# EAGLE design BatteryTemp (EAGLE 7.4.0)
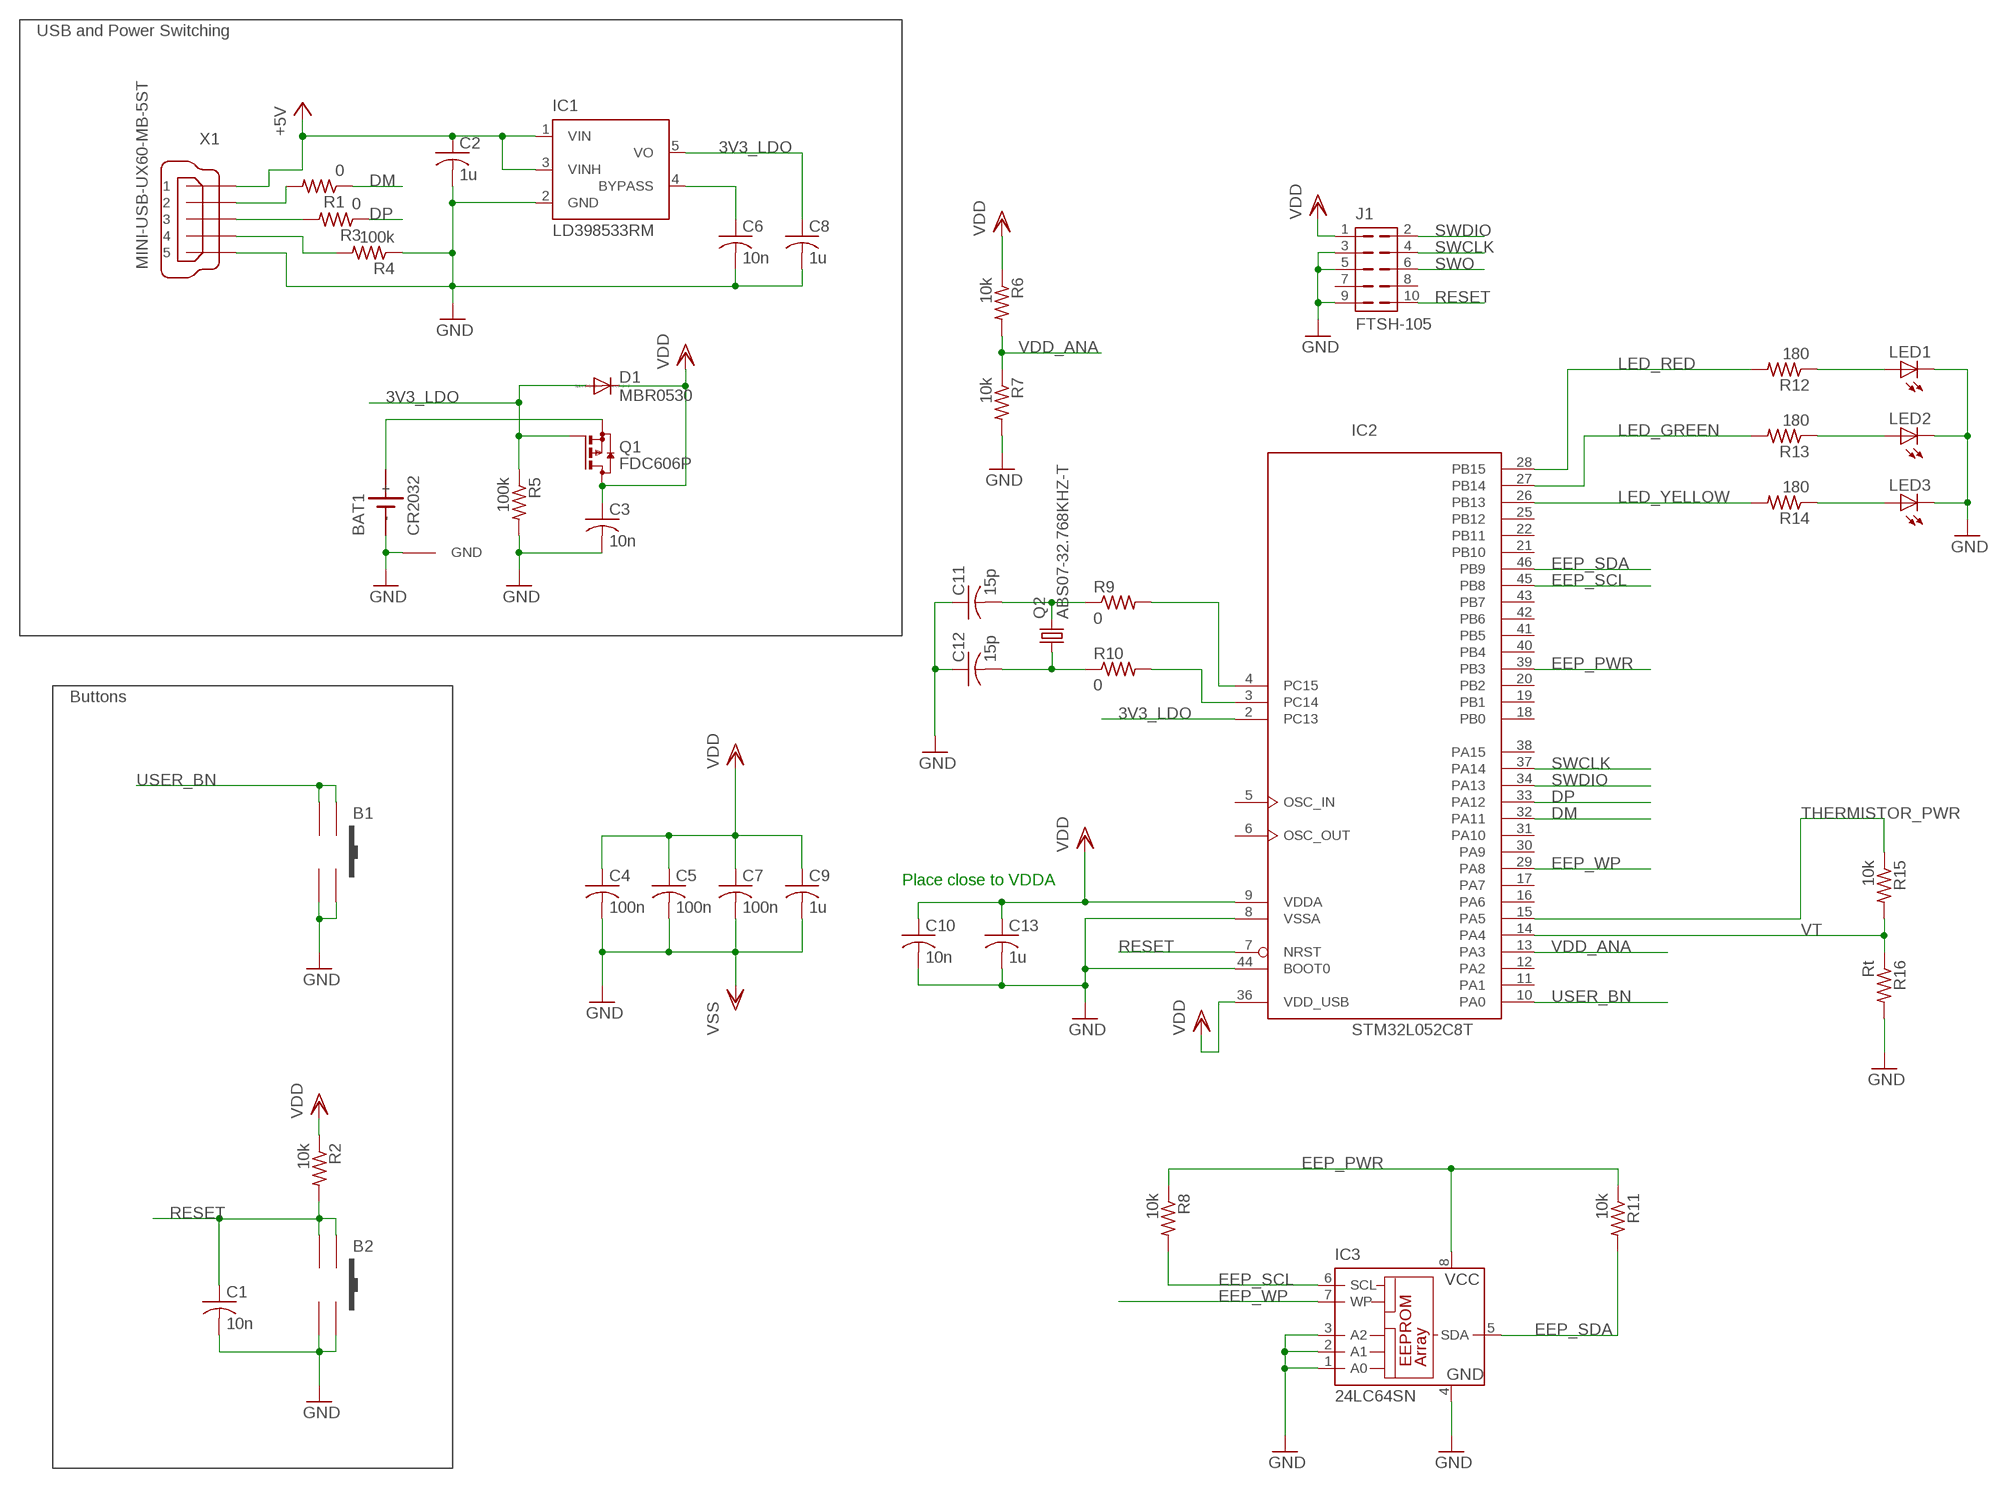
[diagram p0: schematic, sheet 1]

## Parts
B1  PTS525SM10SMTR  [PTS525SM10SMTR]
B2  PTS525SM10SMTR  [PTS525SM10SMTR]
BAT1  CR2032  SN2032  [COIN_CELL]
C1  10n  C-USC0603  [C0603]
C2  1u  C-USC0603  [C0603]
C3  10n  C-USC0603  [C0603]
C4  100n  C-USC0603  [C0603]
C5  100n  C-USC0603  [C0603]
C6  10n  C-USC0603  [C0603]
C7  100n  C-USC0603  [C0603]
C8  1u  C-USC0603  [C0603]
C9  1u  C-USC0603  [C0603]
C10  10n  C-USC0603  [C0603]
C11  15p  C-USC0603  [C0603]
C12  15p  C-USC0603  [C0603]
C13  1u  C-USC0603  [C0603]
D1  MBR0530  CGRM4001-G  [SOD-123_MINI-SMA]
IC1  LD398533RM  [SOT23-5L]
IC2  STM32L052C8T  [LQFP48]
IC3  24LC64SN  [SO-08]
J1  FTSH-105  [FTSH-105-01-XXX-DV-K]
LED1  LEDCHIP-LED0603  [CHIP-LED0603]
LED2  LEDCHIP-LED0603  [CHIP-LED0603]
LED3  LEDCHIP-LED0603  [CHIP-LED0603]
Q1  FDC606P  [SOT-23-6]
Q2  ABS07-32.768KHZ-T  [2-SMD]
R1  0  R-US_R0603  [R0603]
R2  10k  R-US_R0603  [R0603]
R3  0  R-US_R0603  [R0603]
R4  100k  R-US_R0603  [R0603]
R5  100k  R-US_R0603  [R0603]
R6  10k  R-US_R0603  [R0603]
R7  10k  R-US_R0603  [R0603]
R8  10k  R-US_R0603  [R0603]
R9  0  R-US_R0603  [R0603]
R10  0  R-US_R0603  [R0603]
R11  10k  R-US_R0603  [R0603]
R12  180  R-US_R0603  [R0603]
R13  180  R-US_R0603  [R0603]
R14  180  R-US_R0603  [R0603]
R15  10k  R-US_R0603  [R0603]
R16  Rt  R-US_R0603  [R0603]
T1  GND_LUG  [GND_PAD]
X1  MINI-USB-UX60-MB-5ST  [UX60-MB-5ST]

## Nets
3V3_LDO: C8.1 D1.A IC1.5(VO) IC2.2(PC13) Q1.3(G) R5.1
+5V: C2.1 IC1.1(VIN) IC1.3(VINH) X1.1
DM: IC2.32(PA11) R1.1
DP: IC2.33(PA12) R3.1
EEP_PWR: IC2.39(PB3) IC3.8(VCC) R8.1 R11.1
EEP_SCL: IC2.45(PB8) IC3.6(SCL) R8.2
EEP_SDA: IC2.46(PB9) IC3.5(SDA) R11.2
EEP_WP: IC2.29(PA8) IC3.7(WP)
GND: B1.3 B1.4 B2.3 B2.4 BAT1.GND1(-) C1.2 C2.2 C3.2 C4.2 C5.2 C6.2 C7.2 C8.2 C9.2 C10.2 C11.1 C12.1 C13.2 IC1.2(GND) IC2.8(VSSA) IC2.44(BOOT0) IC3.1(A0) IC3.2(A1) IC3.3(A2) IC3.4(GND) J1.3 J1.5 J1.9 LED1.C LED2.C LED3.C R4.1 R5.2 R7.2 R16.2 T1.P$1(GND) X1.5 ; supply symbol labelled VSS
LED_GREEN: IC2.27(PB14) R13.2
LED_RED: IC2.28(PB15) R12.2
LED_YELLOW: IC2.26(PB13) R14.2
N$1: R1.2 X1.2
N$2: R3.2 X1.3
N$3: R4.2 X1.4
N$4: BAT1.VPLUS1(+) BAT1.VPLUS2(+) Q1.4(S)
N$5: LED1.A R12.1
N$6: C6.1 IC1.4(BYPASS)
N$7: C11.2 Q2.P$2 R9.1
N$8: LED2.A R13.1
N$9: LED3.A R14.1
N$10: C12.2 Q2.P$1 R10.1
N$11: IC2.4(PC15) R9.2
N$12: IC2.3(PC14) R10.2
RESET: B2.1 B2.2 C1.1 IC2.7(NRST) J1.10 R2.2
SWCLK: IC2.37(PA14) J1.4
SWDIO: IC2.34(PA13) J1.2
SWO: J1.6
THERMISTOR_PWR: IC2.15(PA5) R15.1
USER_BN: B1.1 B1.2 IC2.10(PA0)
VDD: C3.1 C4.1 C5.1 C7.1 C9.1 C10.1 C13.1 D1.C IC2.9(VDDA) IC2.36(VDD_USB) J1.1 Q1.1(D) Q1.2(D) Q1.5(D) Q1.6(D) R2.1 R6.1
VDD_ANA: IC2.13(PA3) R6.2 R7.1
VT: IC2.14(PA4) R15.2 R16.1
Unconnected: IC2.5(OSC_IN) IC2.6(OSC_OUT) IC2.11(PA1) IC2.12(PA2) IC2.16(PA6) IC2.17(PA7) IC2.18(PB0) IC2.19(PB1) IC2.20(PB2) IC2.21(PB10) IC2.22(PB11) IC2.25(PB12) IC2.30(PA9) IC2.31(PA10) IC2.38(PA15) IC2.40(PB4) IC2.41(PB5) IC2.42(PB6) IC2.43(PB7) J1.7 J1.8

## Notes on the sheet
- USB and Power Switching
- Buttons
- Place close to VDDA

## Power pins joined to a net without a drawn wire
GND: IC2.23(VSS) IC2.35(VSS) IC2.47(VSS)
VDD: IC2.1(VDD) IC2.24(VDD) IC2.48(VDD)

## Library data of the parts
B1 B2 = NicksParts:PTS525SM10SMTR; DIGIKEY: CKN9104CT-ND
BAT1 = NicksParts:SN2032: LI BATTERY; DIGIKEY: BK-913-ND
C1-C9 C11-C13 = resistor:C-US: CAPACITOR, American symbol
C10 = resistor:C-US: CAPACITOR, American symbol; DIGIKEY: 490-1512-1-ND
D1 = diode:CGRM400*-G: Molded plasitc,JEDEC SOD-123/Mini SMA Source: Comchip CGRM4001-G.pdf; DIGIKEY: MBR0530TPMSCT-ND
IC1 = st-microelectronics:LD3985: Ultra low drop and low noise BiCMOS voltage regulators Source: www.st.com LD3985.pdf; DIGIKEY: 497-3504-1-ND
IC2 = micro-stm_v2:STM32L052C*T: ARM 32-bit Cortex™-M0+ CPU 32 MHz maximum frequency 32 to 64 Kbytes of Flash memory 2 kbyte of Data EEPROM 8 kbytes of SRAM 37 GPIOs 1.8 to 3.6 V application supply; DIGIKEY: 497-14903-ND
IC3 = microchip:24*: Serial EEPROM I2C; MF: MICROCHIP; MPN: 24LC64-I/SN; OC_FARNELL: 9758070; OC_NEWARK: 12C2020
J1 = NicksParts:FTSH-105; DIGIKEY: SAM1161-50-ND
LED1 = led:LED: LED OSRAM: - CHIPLED LG R971, LG N971, LY N971, LG Q971, LY Q971, LO R971, LY R971 LH N974, LH R974 LS Q976, LO Q976, LY Q976 LO Q996 - Hyper CHIPLED LW Q18S LB Q993, LB Q99A, LB R99A - SideLED LS A670, LO A670, LY A670, LG A670, LP A670 LB A673, LV A673, LT A673, LW A673 LH A674 LY A675 LS A676, LA A676, LO A676, LY A676, LW A676 LS A679, LY A679, LG A679 - Hyper Micro SIDELED® LS Y876, LA Y876, LO Y876, LY Y876 LT Y87S - SmartLED LW L88C, LW L88S LB L89C, LB L89S, LG L890 LS L89K, LO L89K, LY L89K LS L896, LA L896, LO L896, LY L896 - TOPLED LS T670, LO T670, LY T670, LG T670, LP T670 LSG T670, LSP T670, LSY T670, LOP T670, LYG T670 LG T671, LOG T671, LSG T671 LB T673, LV T673, LT T673, LW T673 LH T674 LS T676, LA T676, LO T676, LY T676, LB T676, LH T676, LSB T676, LW T676 LB T67C, LV T67C, LT T67C, LS T67K, LO T67K, LY T67K, LW E67C LS E67B, LA E67B, LO E67B, LY E67B, LB E67C, LV E67C, LT E67C LW T67C LS T679, LY T679, LG T679 LS T770, LO T770, LY T770, LG T770, LP T770 LB T773, LV T773, LT T773, LW T773 LH T774 LS E675, LA E675, LY E675, LS T675 LS T776, LA T776, LO T776, LY T776, LB T776 LHGB T686 LT T68C, LB T68C - Hyper Mini TOPLED® LB M676 - Mini TOPLED Santana® LG M470 LS M47K, LO M47K, LY M47K Source: http://www.osram.convergy.de LUXEON: - LUMILED® LXK2-PW12-R00, LXK2-PW12-S00, LXK2-PW14-U00, LXK2-PW14-V00 LXK2-PM12-R00, LXK2-PM12-S00, LXK2-PM14-U00 LXK2-PE12-Q00, LXK2-PE12-R00, LXK2-PE12-S00, LXK2-PE14-T00, LXK2-PE14-U00 LXK2-PB12-K00, LXK2-PB12-L00, LXK2-PB12-M00, LXK2-PB14-N00, LXK2-PB14-P00, LXK2-PB14-Q00 LXK2-PR12-L00, LXK2-PR12-M00, LXK2-PR14-Q00, LXK2-PR14-R00 LXK2-PD12-Q00, LXK2-PD12-R00, LXK2-PD12-S00 LXK2-PH12-R00, LXK2-PH12-S00 LXK2-PL12-P00, LXK2-PL12-Q00, LXK2-PL12-R00 Source: www.luxeon.com KINGBRIGHT: KA-3528ASYC Source: www.kingbright.com; DIGIKEY: 475-2506-1-ND
LED2 = led:LED: LED OSRAM: - CHIPLED LG R971, LG N971, LY N971, LG Q971, LY Q971, LO R971, LY R971 LH N974, LH R974 LS Q976, LO Q976, LY Q976 LO Q996 - Hyper CHIPLED LW Q18S LB Q993, LB Q99A, LB R99A - SideLED LS A670, LO A670, LY A670, LG A670, LP A670 LB A673, LV A673, LT A673, LW A673 LH A674 LY A675 LS A676, LA A676, LO A676, LY A676, LW A676 LS A679, LY A679, LG A679 - Hyper Micro SIDELED® LS Y876, LA Y876, LO Y876, LY Y876 LT Y87S - SmartLED LW L88C, LW L88S LB L89C, LB L89S, LG L890 LS L89K, LO L89K, LY L89K LS L896, LA L896, LO L896, LY L896 - TOPLED LS T670, LO T670, LY T670, LG T670, LP T670 LSG T670, LSP T670, LSY T670, LOP T670, LYG T670 LG T671, LOG T671, LSG T671 LB T673, LV T673, LT T673, LW T673 LH T674 LS T676, LA T676, LO T676, LY T676, LB T676, LH T676, LSB T676, LW T676 LB T67C, LV T67C, LT T67C, LS T67K, LO T67K, LY T67K, LW E67C LS E67B, LA E67B, LO E67B, LY E67B, LB E67C, LV E67C, LT E67C LW T67C LS T679, LY T679, LG T679 LS T770, LO T770, LY T770, LG T770, LP T770 LB T773, LV T773, LT T773, LW T773 LH T774 LS E675, LA E675, LY E675, LS T675 LS T776, LA T776, LO T776, LY T776, LB T776 LHGB T686 LT T68C, LB T68C - Hyper Mini TOPLED® LB M676 - Mini TOPLED Santana® LG M470 LS M47K, LO M47K, LY M47K Source: http://www.osram.convergy.de LUXEON: - LUMILED® LXK2-PW12-R00, LXK2-PW12-S00, LXK2-PW14-U00, LXK2-PW14-V00 LXK2-PM12-R00, LXK2-PM12-S00, LXK2-PM14-U00 LXK2-PE12-Q00, LXK2-PE12-R00, LXK2-PE12-S00, LXK2-PE14-T00, LXK2-PE14-U00 LXK2-PB12-K00, LXK2-PB12-L00, LXK2-PB12-M00, LXK2-PB14-N00, LXK2-PB14-P00, LXK2-PB14-Q00 LXK2-PR12-L00, LXK2-PR12-M00, LXK2-PR14-Q00, LXK2-PR14-R00 LXK2-PD12-Q00, LXK2-PD12-R00, LXK2-PD12-S00 LXK2-PH12-R00, LXK2-PH12-S00 LXK2-PL12-P00, LXK2-PL12-Q00, LXK2-PL12-R00 Source: www.luxeon.com KINGBRIGHT: KA-3528ASYC Source: www.kingbright.com; DIGIKEY: 475-2709-1-ND
LED3 = led:LED: LED OSRAM: - CHIPLED LG R971, LG N971, LY N971, LG Q971, LY Q971, LO R971, LY R971 LH N974, LH R974 LS Q976, LO Q976, LY Q976 LO Q996 - Hyper CHIPLED LW Q18S LB Q993, LB Q99A, LB R99A - SideLED LS A670, LO A670, LY A670, LG A670, LP A670 LB A673, LV A673, LT A673, LW A673 LH A674 LY A675 LS A676, LA A676, LO A676, LY A676, LW A676 LS A679, LY A679, LG A679 - Hyper Micro SIDELED® LS Y876, LA Y876, LO Y876, LY Y876 LT Y87S - SmartLED LW L88C, LW L88S LB L89C, LB L89S, LG L890 LS L89K, LO L89K, LY L89K LS L896, LA L896, LO L896, LY L896 - TOPLED LS T670, LO T670, LY T670, LG T670, LP T670 LSG T670, LSP T670, LSY T670, LOP T670, LYG T670 LG T671, LOG T671, LSG T671 LB T673, LV T673, LT T673, LW T673 LH T674 LS T676, LA T676, LO T676, LY T676, LB T676, LH T676, LSB T676, LW T676 LB T67C, LV T67C, LT T67C, LS T67K, LO T67K, LY T67K, LW E67C LS E67B, LA E67B, LO E67B, LY E67B, LB E67C, LV E67C, LT E67C LW T67C LS T679, LY T679, LG T679 LS T770, LO T770, LY T770, LG T770, LP T770 LB T773, LV T773, LT T773, LW T773 LH T774 LS E675, LA E675, LY E675, LS T675 LS T776, LA T776, LO T776, LY T776, LB T776 LHGB T686 LT T68C, LB T68C - Hyper Mini TOPLED® LB M676 - Mini TOPLED Santana® LG M470 LS M47K, LO M47K, LY M47K Source: http://www.osram.convergy.de LUXEON: - LUMILED® LXK2-PW12-R00, LXK2-PW12-S00, LXK2-PW14-U00, LXK2-PW14-V00 LXK2-PM12-R00, LXK2-PM12-S00, LXK2-PM14-U00 LXK2-PE12-Q00, LXK2-PE12-R00, LXK2-PE12-S00, LXK2-PE14-T00, LXK2-PE14-U00 LXK2-PB12-K00, LXK2-PB12-L00, LXK2-PB12-M00, LXK2-PB14-N00, LXK2-PB14-P00, LXK2-PB14-Q00 LXK2-PR12-L00, LXK2-PR12-M00, LXK2-PR14-Q00, LXK2-PR14-R00 LXK2-PD12-Q00, LXK2-PD12-R00, LXK2-PD12-S00 LXK2-PH12-R00, LXK2-PH12-S00 LXK2-PL12-P00, LXK2-PL12-Q00, LXK2-PL12-R00 Source: www.luxeon.com KINGBRIGHT: KA-3528ASYC Source: www.kingbright.com; DIGIKEY: 475-1196-1-ND
Q1 = NicksParts:FDC606P; DIGIKEY: FDC606PCT-ND
Q2 = NicksParts:ABS07-32.768KHZ-T: SMD-2 32.768 KHz Crystal
R1 R3 = resistor:R-US_: RESISTOR, American symbol; DIGIKEY: P0.0GCT-ND
R2 R5 R8-R11 R13-R15 = resistor:R-US_: RESISTOR, American symbol
R4 = resistor:R-US_: RESISTOR, American symbol; DIGIKEY: P100KGCT-ND
R6 R7 = resistor:R-US_: RESISTOR, American symbol; DIGIKEY: P10KYCT-ND
R12 = resistor:R-US_: RESISTOR, American symbol; DIGIKEY: P180GCT-ND
R16 = resistor:R-US_: RESISTOR, American symbol; DIGIKEY: 490-2436-1-ND
T1 = NicksParts:GND_LUG
X1 = con-hirose:MINI-USB-: MINI USB Connector Source: http://www.hirose.co.jp/cataloge_hp/e24000019.pdf; DIGIKEY: H2959CT-ND; OC_FARNELL: unknown; OC_NEWARK: unknown

## Board
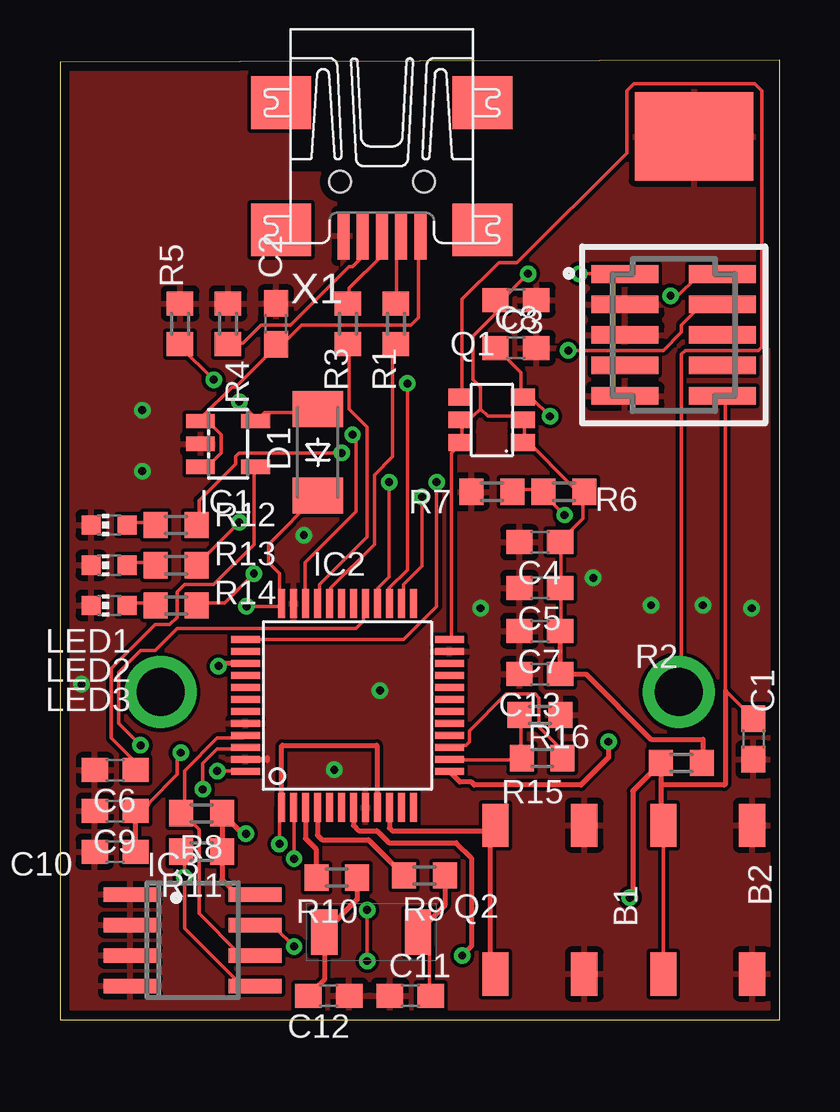
[diagram p1: board, top side]
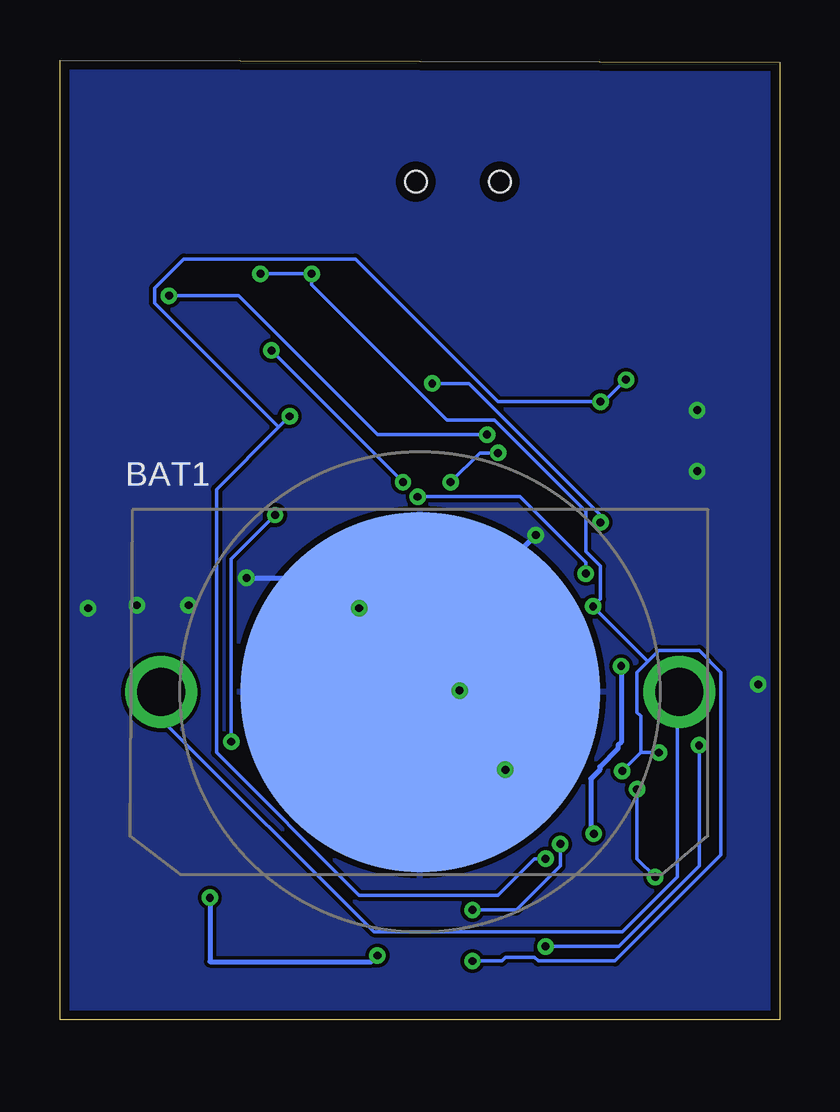
[diagram p2: board, bottom side, seen from below]

Size 30 x 40 mm. Coordinates in mm from the lower left corner, seen from the top.
Outline: 0,0 30,0 30,40 0,39.91 0,0
Copper layers (1*16): Top 0.0356mm / dielectric 1.5011mm / Bottom 0.0356mm
Design rules "oshpark-2layer": minimum track width 6mil, minimum drill 13mil, track to track 6mil, track to pad 6mil, pad to pad 6mil, via to via 6mil, smd to smd 6mil, copper to edge 15mil, drill to drill 6mil, minimum pad ring 7mil, minimum via ring 7mil, stop-mask expansion 4mil, vias tented up to drill 0mil, thermal gap 10mil

### Footprints (pad centres in the part's own frame; a part is rotated, then mirrored left to right if it is on the bottom)
PTS525SM10SMTR = smd 1.8 x 1.1: 1 -3.1,1.85; 2 3.1,1.85; 3 -3.1,-1.85; 4 3.1,-1.85
COIN_CELL = smd 15 x 15: GND1 0,0 | drill 2: VPLUS1 -10.8,0; VPLUS2 10.8,0
C0603 = smd 1.1 x 1: 1 -0.85,0; 2 0.85,0
SOD-123_MINI-SMA = smd 1.5 x 2.1: A 1.8,0; C -1.8,0
SOT23-5L = smd 0.6 x 1.2: 1 -0.95,-1.15; 2 0,-1.15; 3 0.95,-1.15; 4 0.95,1.15; 5 -0.95,1.15
LQFP48 = smd 0.3 x 1.2: 1 -2.75,-4.25; 2 -2.25,-4.25; 3 -1.75,-4.25; 4 -1.25,-4.25; 5 -0.75,-4.25; 6 -0.25,-4.25; 7 0.25,-4.25; 8 0.75,-4.25; 9 1.25,-4.25; 10 1.75,-4.25; 11 2.25,-4.25; 12 2.75,-4.25; 25 2.75,4.25; 26 2.25,4.25; 27 1.75,4.25; 28 1.25,4.25; 29 0.75,4.25; 30 0.25,4.25; 31 -0.25,4.25; 32 -0.75,4.25; 33 -1.25,4.25; 34 -1.75,4.25; 35 -2.25,4.25; 36 -2.75,4.25 | smd 1.2 x 0.3: 13 4.25,-2.75; 14 4.25,-2.25; 15 4.25,-1.75; 16 4.25,-1.25; 17 4.25,-0.75; 18 4.25,-0.25; 19 4.25,0.25; 20 4.25,0.75; 21 4.25,1.25; 22 4.25,1.75; 23 4.25,2.25; 24 4.25,2.75; 37 -4.25,2.75; 38 -4.25,2.25; 39 -4.25,1.75; 40 -4.25,1.25; 41 -4.25,0.75; 42 -4.25,0.25; 43 -4.25,-0.25; 44 -4.25,-0.75; 45 -4.25,-1.25; 46 -4.25,-1.75; 47 -4.25,-2.25; 48 -4.25,-2.75
SO-08 = smd 0.6 x 2.2: 1 -1.905,-2.6; 2 -0.635,-2.6; 3 0.635,-2.6; 4 1.905,-2.6; 5 1.905,2.6; 6 0.635,2.6; 7 -0.635,2.6; 8 -1.905,2.6
FTSH-105-01-XXX-DV-K = smd 0.737 x 2.794: 1 -2.54,-2.032; 2 -2.54,2.032; 3 -1.27,-2.032; 4 -1.27,2.032; 5 0,-2.032; 6 0,2.032; 7 1.27,-2.032; 8 1.27,2.032; 9 2.54,-2.032; 10 2.54,2.032
CHIP-LED0603 = smd 0.8 x 0.8: A 0,-0.75; C 0,0.75
SOT-23-6 = smd 0.7 x 1: 1 -0.95,-1.3; 2 0,-1.3; 3 0.95,-1.3; 4 0.95,1.3; 5 0,1.3; 6 -0.95,1.3
2-SMD = smd 1.1 x 1.9: P$1 -1.95,0; P$2 1.95,0
R0603 = smd 1 x 1.1: 1 -0.85,0; 2 0.85,0
GND_PAD = smd 4.953 x 3.683: P$1 0,0
UX60-MB-5ST = smd 2 x 0.5: 1 2.25,1.6; 2 2.25,0.8; 3 2.25,0; 4 2.25,-0.8; 5 2.25,-1.6 | smd 2.2 x 2.5: M1 -3.3,-4.2; M2 -3.3,4.2; M3 2,4.2; M4 2,-4.2 | hole 0.9: 0,-1.75; 0,1.75

### Placement (x,y rotation side)
B1  20,5 90 top
B2  27,5 90 top
BAT1  14.99,13.65 0 bottom
C1  28.9,11.7 270 top
C2  9,29 90 top
C3  19,30 0 top
C4  20,19.9 180 top
C5  20,18 180 top
C6  2.3,10.4 180 top
C7  20,16.2 180 top
C8  19,28 0 top
C9  2.3,8.7 180 top
C10  2.3,7 180 top
C11  14.6,1 0 top
C12  11.2,1 180 top
C13  20,14.4 180 top
D1  10.74,23.65 90 top
IC1  7,24 270 top
IC2  11.98,13.09 0 top
IC3  5.52,3.31 270 top
J1  25.58,28.54 270 top
LED1  2.04,20.61 90 top
LED2  2.04,18.94 90 top
LED3  2.04,17.26 90 top
Q1  18,25 90 top
Q2  12.97,3.64 0 top
R1  14,29 90 top
R2  25.9,10.7 180 top
R3  12,29 90 top
R4  7,29 270 top
R5  5,29 90 top
R6  21,22 180 top
R7  18,22 180 top
R8  5.9,8.6 180 top
R9  15.19,6.01 180 top
R10  11.53,5.92 180 top
R11  5.9,7 180 top
R12  4.84,20.61 0 top
R13  4.84,18.94 0 top
R14  4.84,17.26 0 top
R15  20.1,10.9 180 top
R16  20,12.7 0 top
T1  26.43,36.81 0 top
X1  13.42,34.92 270 top

### Tracks (layer width: path | path; a pad name or v marks a point on that pad's centre or on a via)
3V3_LDO  (via drill 0.33)
  Top 0.152: v6.4,26.67 5.03,28.04 R5.1 | 8.23,24.99 v7.47,25.76 | 8.23,24.99 8.53,25.3 10.67,25.3 D1.A | 8.23,24.99 IC1.5 | C8.1 18.29,27.89 19.2,26.98 19.2,26.06 Q1.3 19.36,25.91 19.66,25.91 v20.42,25.15 | v9.75,6.71 9.75,8.84 IC2.2
  Bottom 0.152: v6.4,26.67 7.32,25.76 v7.47,25.76 11.73,25.76 17.68,31.7 24.84,31.7 26.06,30.48 26.06,29.87 20.88,24.69 | v9.75,6.71 10.21,6.71 11.73,5.18 17.53,5.18 23.47,11.12 23.47,22.1 20.88,24.69 | v20.42,25.15 20.88,24.69
+5V
  Top 0.152: 5.94,25.15 5.79,24.99 IC1.1 5.94,25.15 | 5.94,25.15 7.16,26.36 7.32,26.36 8.99,28.04 C2.1 9.14,28.04 10.06,28.96 14.63,28.96 14.94,29.26 14.94,32.61 X1.1 | 5.94,25.15 6.71,24.38 6.71,23.62 6.25,23.16 5.94,23.16 IC1.3
DM
  Top 0.152: R1.1 13.87,28.04 13.87,23.47 13.11,22.71 13.11,19.81 11.28,17.98 11.28,17.37 IC2.32
DP
  Top 0.152: R3.1 12.04,28.04 12.04,25.45 12.8,24.69 12.8,20.12 10.82,18.14 10.82,17.37 IC2.33
EEP_PWR  (via drill 0.33)
  Top 0.203: IC2.39 6.71,14.84 v6.6,14.73 | v7.75,7.75 7.6,7.75 R8.1 R11.1 6.75,5.82 7.37,5.21 IC3.8
  Bottom 0.203: v6.6,14.73 6.6,11.56 6.73,11.43 6.73,11.3 7.49,10.54 7.49,10.41 7.87,10.03 7.87,7.87 v7.75,7.75
EEP_SCL
  Top 0.152: IC2.45 7.62,11.73 6.55,11.73 5.18,10.36 5.18,8.69 R8.2 5.18,8.53 5.79,7.92 5.79,4.42 7.47,2.74 8.08,2.74 IC3.6
EEP_SDA  (via drill 0.33)
  Top 0.152: R11.2 5.18,6.86 v5.18,5.94 5.18,3.81 7.47,1.52 8.08,1.52 IC3.5 | v5.94,9.6 5.94,10.67 6.55,11.28 7.62,11.28 IC2.46
  Bottom 0.152: v5.94,9.6 5.94,6.71 v5.18,5.94
EEP_WP  (via drill 0.33)
  Top 0.152: v3.35,11.43 2.44,12.34 2.44,14.48 3.35,15.39 3.96,15.39 4.88,16.31 12.34,16.31 12.65,16.61 12.65,17.22 IC2.29 | v9.75,3.05 8.99,3.81 8.23,3.81 IC3.7
  Bottom 0.152: v3.35,11.43 3.35,6.4 6.71,3.05 v9.75,3.05
GND  (via drill 0.33)
  Top 0.203: IC2.47 8.55,10.84 8.64,10.92 8.64,10.79
  Bottom 0.203: v22.23,18.41 18.8,18.41 v17.53,17.14 | v10.16,20.19 13.34,17.02 v13.34,13.72 11.43,11.81 v11.43,10.41
  other vias: 26.8,17.27 28.83,17.14 3.43,22.86 3.43,25.4 0.89,13.97 24.64,17.27
  pour Bottom: 0.38,39.5 29.59,39.5 29.72,39.37 29.72,0.25 0.38,0.25 0.25,0.38 0.25,39.5
  pour Top: 29.59,39.5 0.38,39.5 0.25,39.37 0.25,0.25 29.59,0.25 29.72,0.38 29.72,39.5
LED_GREEN  (via drill 0.33)
  Top 0.152: v7.47,20.73 5.79,19.05 R13.2 | v14.48,26.52 14.48,18.75 13.72,17.98 13.72,17.37 IC2.27
  Bottom 0.152: v7.47,20.73 7.47,21.03 12.95,26.52 v14.48,26.52
LED_RED  (via drill 0.33)
  Top 0.152: v11.73,23.62 7.47,23.62 7.32,23.47 7.32,23.16 5.79,21.64 5.79,20.73 R12.2 | v13.72,22.4 13.72,18.44 13.26,17.98 13.26,17.37 IC2.28
  Bottom 0.152: v11.73,23.62 12.5,23.62 v13.72,22.4
LED_YELLOW  (via drill 0.33)
  Top 0.152: v8.08,18.59 6.86,17.37 5.79,17.37 R14.2 | v15.09,21.79 15.09,18.9 14.33,18.14 14.33,17.37 IC2.26
  Bottom 0.152: v8.08,18.59 8.08,19.05 10.82,21.79 v15.09,21.79
N$1
  Top 0.152: R1.2 14.02,29.87 14.02,32.46 14.17,32.61 X1.2
N$2
  Top 0.152: R3.2 12.04,29.87 12.04,30.48 13.41,31.85 13.41,32.61 X1.3
N$3
  Top 0.152: R4.2 7.01,28.19 7.62,28.19 8.38,28.96 9.6,28.96 12.04,31.39 12.19,31.39 12.5,31.7 12.5,32.61 X1.4
N$4
  Top 0.152: Q1.4 16.76,26.06 16.76,30.02 18.29,31.55 19.05,31.55 23.62,36.12 23.62,38.71 23.93,39.01 28.96,39.01 29.26,38.71 29.26,28.04 29.11,27.89 26.06,27.89 25.91,27.74 25.91,13.72 BAT1.VPLUS1
  Bottom 0.152: BAT1.VPLUS2 4.27,13.56 4.27,5.94 6.55,3.66 16.92,3.66 25.76,12.5 25.76,13.56 BAT1.VPLUS1
N$5
  Top 0.152: LED1.A 2.9,20.73 3.96,20.73 R12.1
N$6
  Top 0.152: C6.1 3.05,10.52 3.05,10.82 2.13,11.73 2.13,14.63 3.96,16.46 4.57,16.46 4.88,16.76 4.88,17.83 5.18,18.14 6.4,18.14 8.08,19.81 8.08,23.01 IC1.4
N$7
  Top 0.152: C11.2 15.39,1.07 15.39,3.05 14.94,3.5 Q2.P$2
  Top 0.203: R9.1 16.04,4.76 Q2.P$2
N$8
  Top 0.152: LED2.A 2.9,19.05 3.96,19.05 R13.1
N$9
  Top 0.152: LED3.A 2.9,17.37 3.96,17.37 R14.1
N$10
  Top 0.203: R10.1 12.38,5 Q2.P$1 11.02,1.67 C12.2
N$11
  Top 0.203: IC2.4 10.73,7.68 10.92,7.49 12.86,7.49 R9.2
N$12
  Top 0.203: IC2.3 10.23,7.55 10.67,7.11 10.67,5.94 R10.2
RESET  (via drill 0.33)
  Top 0.152: B2.1 25.15,1.98 25.15,8.08 B2.2 | J1.10 27.74,25.91 27.74,13.72 28.8,12.65 C1.1
  Top 0.203: 25.05,9.78 R2.2 23.88,9.53 23.88,5.21 v23.75,5.08 | 25.05,9.78 25.05,8.2 B2.2 | 27.74,13.72 27.74,9.83 27.69,9.78 25.05,9.78 | IC2.7 12.23,8.09 12.45,7.87 13.21,7.87 13.72,7.37 16.51,7.37 17.14,6.73 17.14,3.05 v16.76,2.67
  Bottom 0.203: v23.75,5.08 23.75,2.41 17.02,2.41 v16.76,2.67
SWCLK  (via drill 0.33)
  Top 0.152: v15.7,22.4 15.7,17.22 14.33,15.85 7.77,15.85 IC2.37 | v21.18,27.89 25.15,27.89 25.91,28.65 25.91,28.96 26.67,29.72 27.58,29.72 J1.4
  Bottom 0.152: v21.18,27.89 v15.7,22.4
SWDIO  (via drill 0.33)
  Top 0.152: v12.19,24.38 12.34,24.23 12.34,21.18 10.21,19.05 10.21,17.37 IC2.34 | v25.45,30.18 25.76,30.18 26.52,30.94 27.58,30.94 J1.2
  Bottom 0.152: v12.19,24.38 16.76,24.38 22.55,30.18 v25.45,30.18
THERMISTOR_PWR
  Top 0.152: R15.1 20.73,11.12 20.73,11.43 19.96,12.19 19.96,13.41 19.81,13.56 18.59,13.56 17.07,12.04 17.07,11.58 16.92,11.43 16.31,11.43 IC2.15
USER_BN
  Top 0.203: IC2.10 13.73,7.99 13.84,7.87 17.92,7.87 | 17.92,7.87 B1.2 | 17.92,7.87 17.92,2.13 B1.1
VDD  (via drill 0.33)
  Top 0.152: C7.1 20.88,16.31 20.88,17.98 C5.1 20.88,18.14 20.88,19.81 C4.1 20.88,19.96 21.79,20.88 21.79,21.95 R6.1 21.79,22.1 21.49,22.1 19.36,24.23 | 19.36,24.23 19.36,24.99 Q1.2 19.2,25.15 17.83,25.15 17.53,25.45 | 19.36,24.23 19.36,24.08 Q1.1 19.36,24.23 | 17.53,25.45 17.53,26.36 17.22,26.67 17.22,28.5 18.14,29.41 18.14,29.87 C3.1 18.29,29.87 v19.51,31.09 | 17.53,25.45 17.22,25.15 16.76,25.15 Q1.5 16.76,24.99 16.76,24.08 Q1.6 16.61,23.93 16.31,23.62 16.31,15.85 IC2.24 | v21.64,31.09 23.47,31.09 J1.1 | D1.C 10.67,21.79 8.69,19.81 8.69,19.05 9.14,18.59 9.14,17.37 IC2.36 9.14,17.22 v7.77,17.22 | v5.03,11.12 4.88,10.97 4.88,10.21 3.68,9.02 3.5,8.84 3.2,8.84 C9.1 | v6.55,10.36 7.62,10.36 IC2.48 | v9.14,7.32 9.14,8.84 IC2.1 | v12.8,2.44 v12.8,4.57
  Top 0.203: C7.1 C13.1 21.92,14.4 24.64,11.68 26.8,11.68 26.8,10.75 R2.1 | IC2.1 9.23,11.39 9.27,11.43 13.21,11.43 13.21,8.86 IC2.9 | C10.1 3.15,8.48 3.68,9.02
  Bottom 0.152: v21.64,31.09 v19.51,31.09 19.51,30.63 13.87,24.99 11.89,24.99 8.08,21.18 8.08,19.51 7.47,18.9 7.47,17.53 v7.77,17.22 5.49,14.94 | 5.79,11.12 v5.03,11.12 | v6.55,10.36 5.79,11.12 | v9.14,7.32 9.14,6.4 10.97,4.57 v12.8,4.57 | v12.8,2.44 11.58,2.44 11.43,2.59 10.21,2.59 10.06,2.44 6.86,2.44 2.44,6.86 2.44,14.48 3.35,15.39 5.03,15.39 5.49,14.94 | 5.49,14.94 5.94,14.48 5.94,12.8 5.79,12.65 5.79,11.12
VDD_ANA  (via drill 0.33)
  Top 0.152: R7.1 18.9,22.1 20.12,22.1 R6.2 20.12,21.95 v21.03,21.03 | 16.31,10.21 IC2.13
  Top 0.203: v22.86,11.58 22.86,10.92 21.72,9.78 17.27,9.78 17.14,9.91 16.67,9.91 IC2.13
  Bottom 0.152: v22.86,11.58 22.86,19.2 v21.03,21.03
VT
  Top 0.152: R16.1 19.2,12.65 19.2,11.12 R15.2 19.05,10.97 18.9,10.82 16.31,10.82 IC2.14

### Text on the board
tNames: Q1 | Q2
tDocu: BattTempV4 / Nick Butts 2015
bDocu: TempMon V1